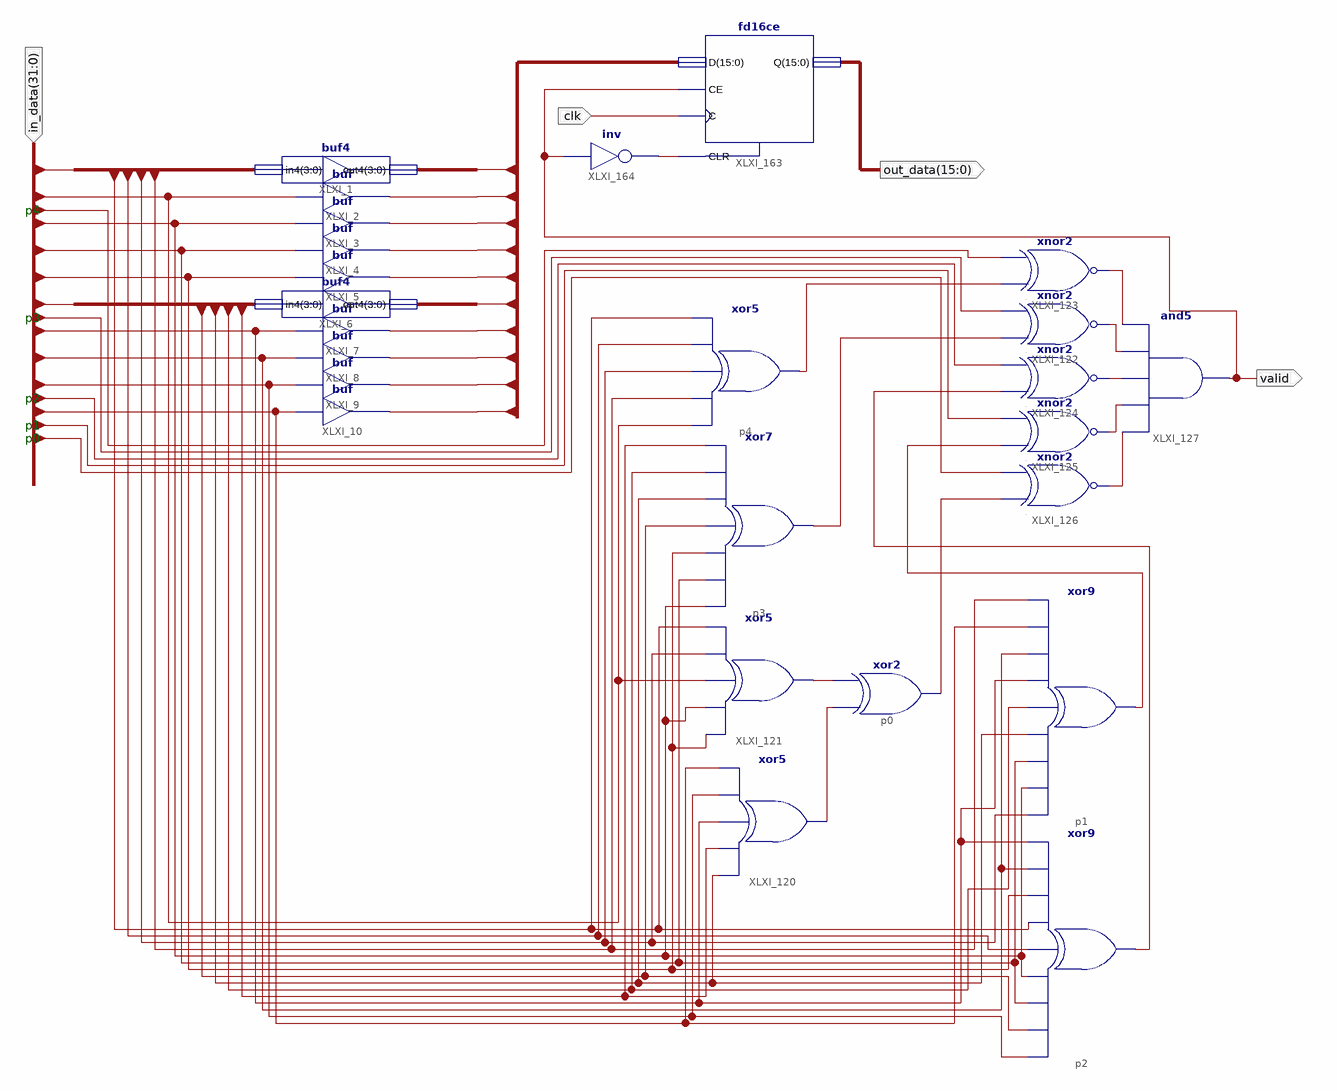
[diagram p0: schematic sheet 1]
// Xilinx ISE schematic hamming_dec.sch (spartan6) as structural Verilog: 25 symbols, 4 ports
module hamming_dec (
  input  [31:0] in_data,
  input  clk,
  output valid,
  output [15:0] out_data
);

  wire testp0, testp1, testp2, testp3, testp4, XLXN_96, XLXN_97, XLXN_98, XLXN_99, XLXN_100, XLXN_101,
       XLXN_102, XLXN_260;
  wire [15:0] data;

  xnor XLXI_126 (XLXN_101, testp0, in_data[6]);
  xor XLXI_121 (XLXN_96, in_data[18], in_data[20], in_data[22], in_data[24], in_data[26]);
  xor XLXI_120 (XLXN_97, in_data[16], in_data[14], in_data[12], in_data[10], in_data[8]);
  xor p4 (testp4, in_data[22], in_data[23], in_data[24], in_data[25], in_data[26]);
  xor p0 (testp0, XLXN_97, XLXN_96);
  xor p2 (testp2, in_data[10], in_data[17], in_data[19], in_data[20], in_data[25], in_data[26], in_data[18], in_data[11], in_data[12]);
  xor p1 (testp1, in_data[24], in_data[20], in_data[19], in_data[16], in_data[15], in_data[12], in_data[11], in_data[8], in_data[23]);
  buf XLXI_7 (data[3], in_data[12]);
  buf XLXI_8 (data[2], in_data[11]);
  buf XLXI_9 (data[1], in_data[10]);
  buf XLXI_10 (data[0], in_data[8]);
  buf XLXI_5 (data[8], in_data[18]);
  buf XLXI_2 (data[11], in_data[22]);
  buf XLXI_3 (data[10], in_data[20]);
  buf XLXI_4 (data[9], in_data[19]);
  buf4 XLXI_6 (.in4(in_data[17:14]), .out4(data[7:4]));
  xnor XLXI_125 (XLXN_102, testp1, in_data[7]);
  xnor XLXI_124 (XLXN_98, testp2, in_data[9]);
  xnor XLXI_122 (XLXN_100, testp3, in_data[13]);
  xnor XLXI_123 (XLXN_99, testp4, in_data[21]);
  and XLXI_127 (valid, XLXN_101, XLXN_102, XLXN_98, XLXN_100, XLXN_99);
  buf4 XLXI_1 (.in4(in_data[26:23]), .out4(data[15:12]));
  fd16ce XLXI_163 (.C(clk), .CE(valid), .CLR(XLXN_260), .D(data), .Q(out_data));
  xor p3 (testp3, in_data[20], in_data[19], in_data[18], in_data[17], in_data[16], in_data[15], in_data[14]);
  not XLXI_164 (XLXN_260, valid);

  // Notes on the sheet:
  //   p4
  //   p3
  //   p2
  //   p1
  //   p0
endmodule
